# Altium schematic sheet 6F.SchDoc
size A
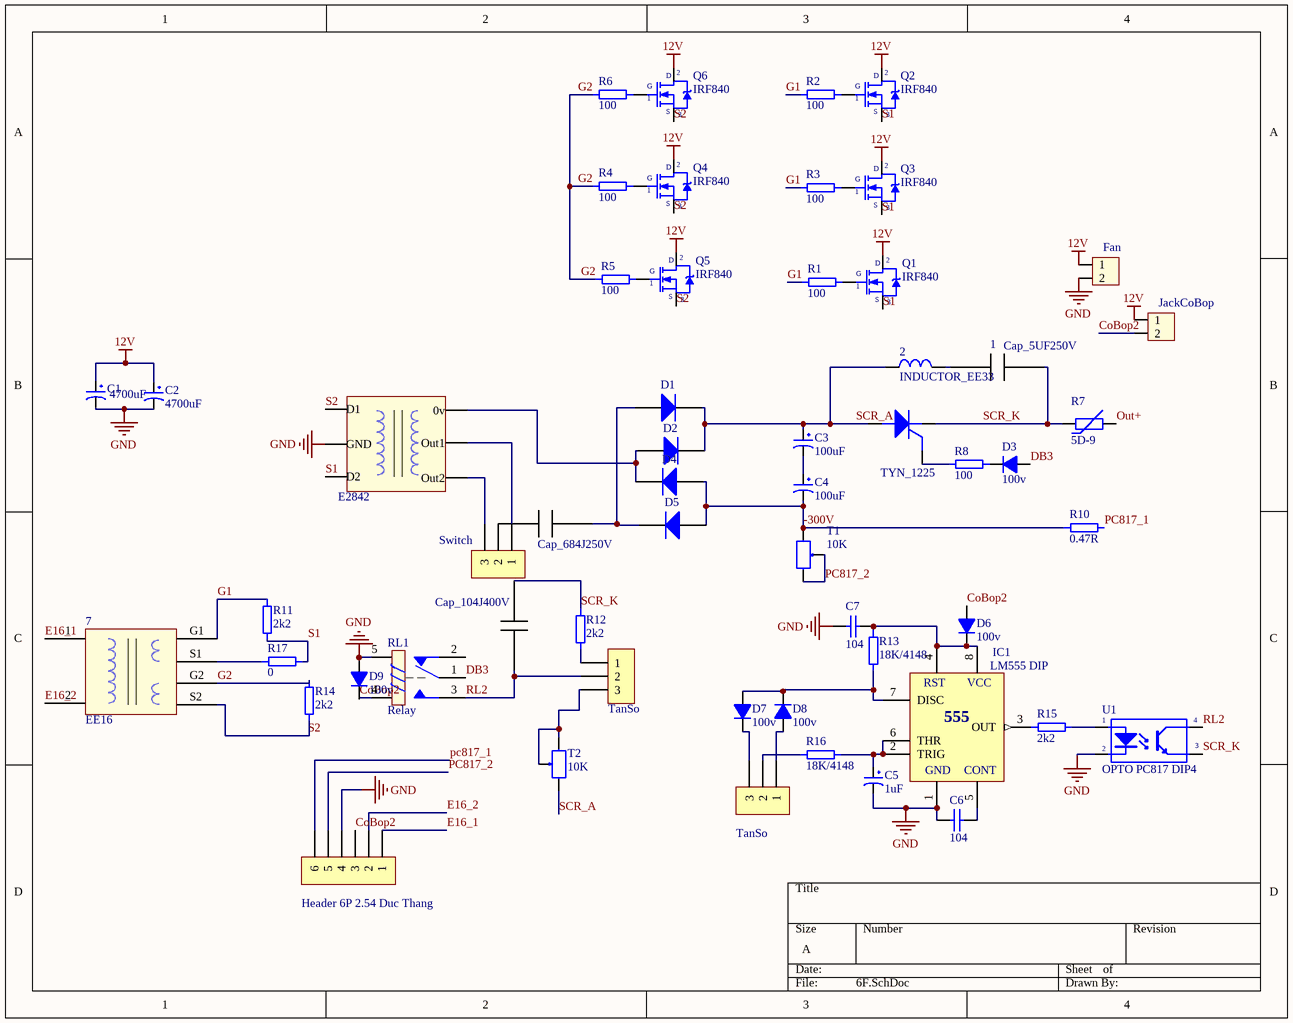
[diagram p0: 6F.SchDoc]

## Parts
1  Cap_5UF250V  [Cap_5UF250V]
2  INDUCTOR_EE33  [EE33]
4  TYN_1225  [QTO-220H3]
5  Cap_684J250V  [Cap_104J400V]
6  Cap_104J400V  [Cap_104J400V]
7  EE16  [EE16]
?  E2842  [E2842]
C1  4700uF  [tu hoa 18mm]
C2  4700uF  [tu hoa 18mm]
C3  100uF  [tu Hoa 18mm]
C4  100uF  [tu Hoa 18mm]
C5  1uF  [tu hoa 5mm]
C6  104  [tu gom]
C7  104  [tu gom]
D1  Diode  [DIODE 0.5A]  (value not drawn)
D2  Diode  [DIODE 0.5A]  (value not drawn)
D3  100v  [DIODE 1A]
D4  Diode  [DIODE 0.5A]  (value not drawn)
D5  Diode  [DIODE 0.5A]  (value not drawn)
D6  100v  [DIODE 1A]
D7  100v  [DIODE 0.5A]
D8  100v  [DIODE 0.5A]
D9  100v  [DIODE 1A]
H1  Fan  [XH2.54M-2]
H2  JackCoBop  [XH2.54M-2]
H5  Switch  [XH2.54M-3]
H6  TanSo  [XH2.54M-3]
H7  TanSo  [XH2.54M-3]
H8  Header 6P 2.54 Duc Thang  [XH2.54M-6]
IC1  LM555 DIP  [DIP8]
Q1  IRF840  [QTO-220]
Q2  IRF840  [QTO-220]
Q3  IRF840  [QTO-220]
Q4  IRF840  [QTO-220]
Q5  IRF840  [QTO-220]
Q6  IRF840  [QTO-220]
R1  100  [PCBComponent_1]
R2  100  [PCBComponent_1]
R3  100  [PCBComponent_1]
R4  100  [PCBComponent_1]
R5  100  [PCBComponent_1]
R6  100  [PCBComponent_1]
R7  5D-9  [tro nhiet d-9]
R8  100  [PCBComponent_1]
R10  0.47R  [Res_5W]
R11  2k2  [PCBComponent_1]
R12  2k2  [PCBComponent_1]
R13  18K/4148  [PCBComponent_1]
R14  2k2  [PCBComponent_1]
R15  2k2  [PCBComponent_1]
R16  18K/4148  [PCBComponent_1]
R17  0  [PCBComponent_1]
RL1  Relay  [Relay 5 Chan SRD]
T1  10K  [Bien Tro Vi Chinh Dung]
T2  10K  [Bien Tro Vi Chinh Dung]
U1  OPTO PC817 DIP4  [DIP4]

## Nets
12V: C1.1 C2.1 H1.1 H2.1 Q1.2(D) Q2.2(D) Q3.2(D) Q4.2(D) Q5.2(D) Q6.2(D)
GND: ?.GND C1.2 C2.2 C5.2 C6.2 C7.2 D9.1(A) H1.2 H8.4 IC1.1(GND) RL1.5 U1.2(K)
-300V: C4.2 D4.1(A) D5.1(A) R10.1 T1.1
CoBop2: D6.1(A) D9.2(K) H2.2 H8.3 RL1.4
DB3: D3.1(A) RL1.1
E16_1: 7.1 H8.1
E16_2: 7.2 H8.2
G1: 7.G1 R1.0 R2.0 R3.0 R11.1
G2: 7.G2 R4.0 R5.0 R6.0 R14.1
Out+: R7.2
pc817_1: H8.6 R10.2
PC817_2: H8.5 T1.2 T1.3
RL2: 6.1 H6.2 RL1.3 U1.4(C)
S1: ?.D2 Q1.3(S) Q2.3(S) Q3.3(S) R11.0 R17.0
S2: 7.S2 ?.D1 Q4.3(S) Q5.3(S) Q6.3(S) R14.0
SCR_A: 2.1 4.2(A) C3.1 D1.2(K) D2.2(K) T2.1
SCR_K: 1.2 4.1(K) 6.2 R7.1 R12.1 U1.3(E)
Net1_1: 1.1 2.7
Net4_3: 4.3(G) R8.0
Net5_1: 5.1 D1.1(A) D5.2(K)
Net5_2: 5.2 H5.2
Net7_S1: 7.S1 R17.1
Net?_0v: ?.0v D2.1(A) D4.2(K)
Net?_Out1: ?.Out1 H5.1
Net?_Out2: ?.Out2 H5.3
NetC3_2: C3.2 C4.1
NetC5_1: C5.1 IC1.2(TRIG) IC1.6(THR) R16.0
NetC6_1: C6.1 IC1.5(CONT)
NetC7_1: C7.1 D6.2(K) IC1.4(RST) IC1.8(VCC) R13.0
NetD3_2: D3.2(K) R8.1
NetD7_1: D7.1(A) D8.2(K) IC1.7(DISC) R13.1
NetD7_2: D7.2(K) H7.3
NetD8_1: D8.1(A) H7.1
NetH6_1: H6.1 R12.0
NetH6_3: H6.3 T2.2 T2.3
NetH7_2: H7.2 R16.1
NetIC1_3: IC1.3(OUT) R15.1
NetQ1_1: Q1.1(G) R1.1
NetQ2_1: Q2.1(G) R2.1
NetQ3_1: Q3.1(G) R3.1
NetQ4_1: Q4.1(G) R4.1
NetQ5_1: Q5.1(G) R5.1
NetQ6_1: Q6.1(G) R6.1
NetR15_0: R15.0 U1.1(A)

Not connected (* = marked no-connect by the designer): RL1 2

## Notes on the sheet
- (in symbol LM555 DIP) 555

## Library data of the parts
1 = Cap_5UF250V: C?
2 = INDUCTOR_EE33: L?
5 = Cap_684J250V: C?
6 = Cap_104J400V: C?
7 = EE16: L?
? = E2842: L?
C1 C2 = Tu Hoa 4700uF 35V 18x30: C?m; So_Chan: 2; Don_Vi: Con; Ten_Linh_Kien: T? Hóa 4700uF 35V 18x30MM; Ma_Hang: MH004427; Chung_Loai: C?m; Kieu_Chan: *
C3 C4 = Tu Hoa 100uF 450V 18x35: C?m; Don_Vi: Con; So_Chan: 2; Ten_Linh_Kien: T? Hóa 100uF 450V 18x35MM; Ma_Hang: MH003953; Chung_Loai: C?m; Kieu_Chan: *
C5 = Tu Hoa 1uF 50V 5x11: C?m; Don_Vi: Con; So_Chan: 2; Ten_Linh_Kien: T? Hóa 1uF 50V 5x11MM; Ma_Hang: MH001355; Chung_Loai: C?m; Kieu_Chan: *
C6 C7 = Tu gom 104 50V: C?m; So_Chan: 2; Ten_Linh_Kien: T? g?m 104 100nF 50V; Don_Vi: Con; Ma_Hang: MH004761; Chung_Loai: C?m; Kieu_Chan: *
D1 D2 D4 D5 = Diode: Default Diode; Code - JEDEC: DO-214-AB; Value: 1N5007; Published: 8-Jun-2000; Revision: July-2002: Re-released for DXP Platform.; Publisher: Altium Limited
D3 D6 D9 = Diode 1N4007: C?m; Ten_Linh_Kien: Diode 1N4007 1A (DIP); Don_Vi: Con; Ma_Hang: MH001063; Ghi Chu: *; Kieu_Chan: *; Chung_Loai: C?m
D7 D8 = Diode 1N4148: C?m; Ten_Linh_Kien: Diode 1N4148 DO35 450mA 100V ( 1N4148 DIP); Don_Vi: Con; Ma_Hang: MH001065; Ghi Chu: *; Kieu_Chan: *; Chung_Loai: C?m
H1 H2 = Header 2P 2.54 Duc Thang: C?m; Ten_Linh_Kien: Header 2P XH2.54-2P Ð?c Th?ng; Don_Vi: Con; Ma_Hang: MH001283; Chung_Loai: C?m
H5-H7 = Header 3P 2.54 Duc Thang: C?m; Ten_Linh_Kien: Header 3P XH2.54-3P Ð?c Th?ng; Don_Vi: Con; Ma_Hang: MH001292; Chung_Loai: C?m
H8 = Header 6P 2.54 Duc Thang: C?m; Ten_Linh_Kien: Header 6P XH2.54-6P Ð?c Th?ng; Don_Vi: Con; Ma_Hang: MH001972; Chung_Loai: C?m
IC1 = LM555 DIP: Dán; Don_Vi: Con; Ma_Hang: MH001514; Ten_Linh_Kien: LM555; Ghi _Chu: *; Kieu_Chan: *; Chung_Loai: Dán
Q1-Q6 = IRF840: MOSFET N - CHANNEL 500V - 0.75 - 8A - TO-220; Value: IRF840
R1-R6 R8 R11-R17 = Res_7.62: R?
R7 = Tro Nhiet NTC 5D-9: C?m; So_Chan: 2; Don_Vi: Con; Ten_Linh_Kien: Ði?n Tr? Nhi?t NTC 5D-9; Ma_Hang: MH005857; Chung_Loai: C?m; Kieu_Chan: *
R10 = Res_5W
RL1 = Relay 5 Chan SRD: Relay 5 Chan; Ma_Hang: MH009374; Ten: Relay 5V10A SRD-05VDC-SL-C Chính Hãng
T1 T2 = Bien Tro Tinh Chinh 10K Dung: C?m; Ma_Hang: MH003232; Ten_Linh_Kien: Bi?n Tr? VR 103-10K 3296W; Don_Vi: Con; Kieu_Chan: *; Chung_Loai: C?m; Ghi_Chu: *
U1 = OPTO PC817 DIP4: Single Opto; Value: PC817